# Altium schematic sheet FMC_HPC_TO_LPC_BREAKOUT_ROW_HPC1.SchDoc: High-pin count (HPC) row A, B, and C pass-through
size A4; Date: 12.12.2024; DrawnBy: PFH; Engineer: PFH; DocumentNumber: 1; Revision: A; SheetNumber: 2; SheetTotal: 3; Projekt: FMC HPC to LPC breakout module (single width); Website: www.fmchub.com; ProjectName: FMC_Single_LPC_BREAKOUT
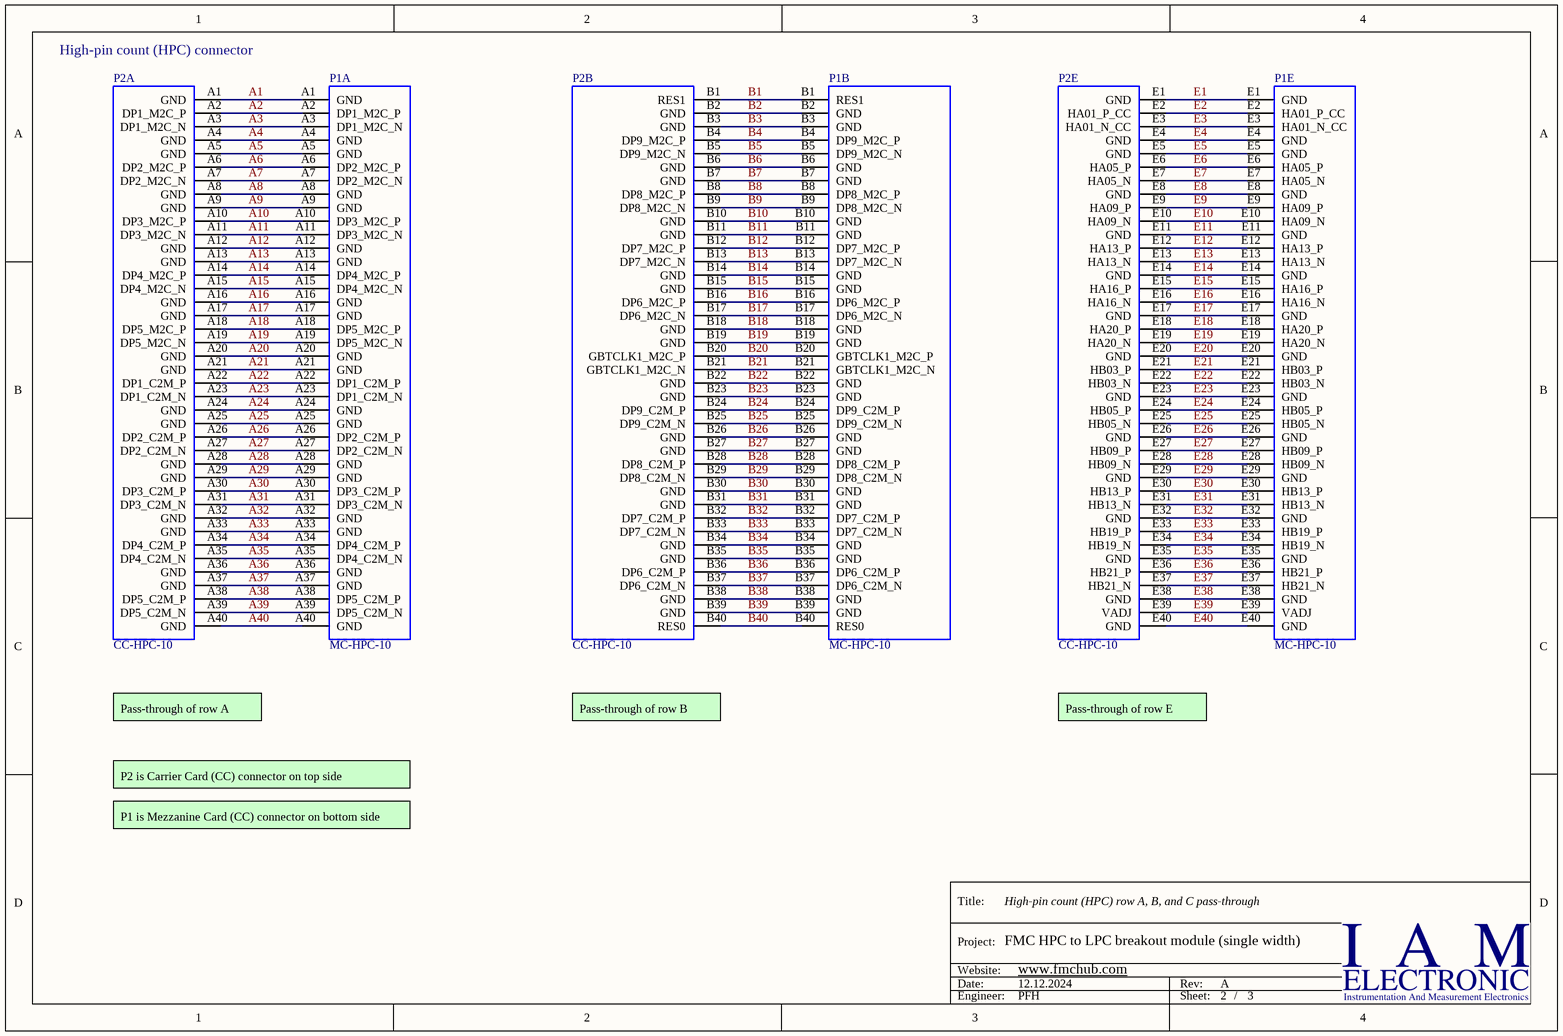
[diagram p0: FMC_HPC_TO_LPC_BREAKOUT_ROW_HPC1.SchDoc]

## Parts
P1  MC-HPC-10  [ASP-134488-01]  (parts A,B,E of 10)
P2  CC-HPC-10  [ASP-134486-01]  (parts A,B,E of 10)

## Nets
A1: P1.A1(GND) P2.A1(GND)
A2: P1.A2(DP1_M2C_P) P2.A2(DP1_M2C_P)
A3: P1.A3(DP1_M2C_N) P2.A3(DP1_M2C_N)
A4: P1.A4(GND) P2.A4(GND)
A5: P1.A5(GND) P2.A5(GND)
A6: P1.A6(DP2_M2C_P) P2.A6(DP2_M2C_P)
A7: P1.A7(DP2_M2C_N) P2.A7(DP2_M2C_N)
A8: P1.A8(GND) P2.A8(GND)
A9: P1.A9(GND) P2.A9(GND)
A10: P1.A10(DP3_M2C_P) P2.A10(DP3_M2C_P)
A11: P1.A11(DP3_M2C_N) P2.A11(DP3_M2C_N)
A12: P1.A12(GND) P2.A12(GND)
A13: P1.A13(GND) P2.A13(GND)
A14: P1.A14(DP4_M2C_P) P2.A14(DP4_M2C_P)
A15: P1.A15(DP4_M2C_N) P2.A15(DP4_M2C_N)
A16: P1.A16(GND) P2.A16(GND)
A17: P1.A17(GND) P2.A17(GND)
A18: P1.A18(DP5_M2C_P) P2.A18(DP5_M2C_P)
A19: P1.A19(DP5_M2C_N) P2.A19(DP5_M2C_N)
A20: P1.A20(GND) P2.A20(GND)
A21: P1.A21(GND) P2.A21(GND)
A22: P1.A22(DP1_C2M_P) P2.A22(DP1_C2M_P)
A23: P1.A23(DP1_C2M_N) P2.A23(DP1_C2M_N)
A24: P1.A24(GND) P2.A24(GND)
A25: P1.A25(GND) P2.A25(GND)
A26: P1.A26(DP2_C2M_P) P2.A26(DP2_C2M_P)
A27: P1.A27(DP2_C2M_N) P2.A27(DP2_C2M_N)
A28: P1.A28(GND) P2.A28(GND)
A29: P1.A29(GND) P2.A29(GND)
A30: P1.A30(DP3_C2M_P) P2.A30(DP3_C2M_P)
A31: P1.A31(DP3_C2M_N) P2.A31(DP3_C2M_N)
A32: P1.A32(GND) P2.A32(GND)
A33: P1.A33(GND) P2.A33(GND)
A34: P1.A34(DP4_C2M_P) P2.A34(DP4_C2M_P)
A35: P1.A35(DP4_C2M_N) P2.A35(DP4_C2M_N)
A36: P1.A36(GND) P2.A36(GND)
A37: P1.A37(GND) P2.A37(GND)
A38: P1.A38(DP5_C2M_P) P2.A38(DP5_C2M_P)
A39: P1.A39(DP5_C2M_N) P2.A39(DP5_C2M_N)
A40: P1.A40(GND) P2.A40(GND)
B1: P1.B1(RES1) P2.B1(RES1)
B2: P1.B2(GND) P2.B2(GND)
B3: P1.B3(GND) P2.B3(GND)
B4: P1.B4(DP9_M2C_P) P2.B4(DP9_M2C_P)
B5: P1.B5(DP9_M2C_N) P2.B5(DP9_M2C_N)
B6: P1.B6(GND) P2.B6(GND)
B7: P1.B7(GND) P2.B7(GND)
B8: P1.B8(DP8_M2C_P) P2.B8(DP8_M2C_P)
B9: P1.B9(DP8_M2C_N) P2.B9(DP8_M2C_N)
B10: P1.B10(GND) P2.B10(GND)
B11: P1.B11(GND) P2.B11(GND)
B12: P1.B12(DP7_M2C_P) P2.B12(DP7_M2C_P)
B13: P1.B13(DP7_M2C_N) P2.B13(DP7_M2C_N)
B14: P1.B14(GND) P2.B14(GND)
B15: P1.B15(GND) P2.B15(GND)
B16: P1.B16(DP6_M2C_P) P2.B16(DP6_M2C_P)
B17: P1.B17(DP6_M2C_N) P2.B17(DP6_M2C_N)
B18: P1.B18(GND) P2.B18(GND)
B19: P1.B19(GND) P2.B19(GND)
B20: P1.B20(GBTCLK1_M2C_P) P2.B20(GBTCLK1_M2C_P)
B21: P1.B21(GBTCLK1_M2C_N) P2.B21(GBTCLK1_M2C_N)
B22: P1.B22(GND) P2.B22(GND)
B23: P1.B23(GND) P2.B23(GND)
B24: P1.B24(DP9_C2M_P) P2.B24(DP9_C2M_P)
B25: P1.B25(DP9_C2M_N) P2.B25(DP9_C2M_N)
B26: P1.B26(GND) P2.B26(GND)
B27: P1.B27(GND) P2.B27(GND)
B28: P1.B28(DP8_C2M_P) P2.B28(DP8_C2M_P)
B29: P1.B29(DP8_C2M_N) P2.B29(DP8_C2M_N)
B30: P1.B30(GND) P2.B30(GND)
B31: P1.B31(GND) P2.B31(GND)
B32: P1.B32(DP7_C2M_P) P2.B32(DP7_C2M_P)
B33: P1.B33(DP7_C2M_N) P2.B33(DP7_C2M_N)
B34: P1.B34(GND) P2.B34(GND)
B35: P1.B35(GND) P2.B35(GND)
B36: P1.B36(DP6_C2M_P) P2.B36(DP6_C2M_P)
B37: P1.B37(DP6_C2M_N) P2.B37(DP6_C2M_N)
B38: P1.B38(GND) P2.B38(GND)
B39: P1.B39(GND) P2.B39(GND)
B40: P1.B40(RES0) P2.B40(RES0)
E1: P1.E1(GND) P2.E1(GND)
E2: P1.E2(HA01_P_CC) P2.E2(HA01_P_CC)
E3: P1.E3(HA01_N_CC) P2.E3(HA01_N_CC)
E4: P1.E4(GND) P2.E4(GND)
E5: P1.E5(GND) P2.E5(GND)
E6: P1.E6(HA05_P) P2.E6(HA05_P)
E7: P1.E7(HA05_N) P2.E7(HA05_N)
E8: P1.E8(GND) P2.E8(GND)
E9: P1.E9(HA09_P) P2.E9(HA09_P)
E10: P1.E10(HA09_N) P2.E10(HA09_N)
E11: P1.E11(GND) P2.E11(GND)
E12: P1.E12(HA13_P) P2.E12(HA13_P)
E13: P1.E13(HA13_N) P2.E13(HA13_N)
E14: P1.E14(GND) P2.E14(GND)
E15: P1.E15(HA16_P) P2.E15(HA16_P)
E16: P1.E16(HA16_N) P2.E16(HA16_N)
E17: P1.E17(GND) P2.E17(GND)
E18: P1.E18(HA20_P) P2.E18(HA20_P)
E19: P1.E19(HA20_N) P2.E19(HA20_N)
E20: P1.E20(GND) P2.E20(GND)
E21: P1.E21(HB03_P) P2.E21(HB03_P)
E22: P1.E22(HB03_N) P2.E22(HB03_N)
E23: P1.E23(GND) P2.E23(GND)
E24: P1.E24(HB05_P) P2.E24(HB05_P)
E25: P1.E25(HB05_N) P2.E25(HB05_N)
E26: P1.E26(GND) P2.E26(GND)
E27: P1.E27(HB09_P) P2.E27(HB09_P)
E28: P1.E28(HB09_N) P2.E28(HB09_N)
E29: P1.E29(GND) P2.E29(GND)
E30: P1.E30(HB13_P) P2.E30(HB13_P)
E31: P1.E31(HB13_N) P2.E31(HB13_N)
E32: P1.E32(GND) P2.E32(GND)
E33: P1.E33(HB19_P) P2.E33(HB19_P)
E34: P1.E34(HB19_N) P2.E34(HB19_N)
E35: P1.E35(GND) P2.E35(GND)
E36: P1.E36(HB21_P) P2.E36(HB21_P)
E37: P1.E37(HB21_N) P2.E37(HB21_N)
E38: P1.E38(GND) P2.E38(GND)
E39: P1.E39(VADJ) P2.E39(VADJ)
E40: P1.E40(GND) P2.E40(GND)

## Notes on the sheet
- (near P2) High-pin count (HPC) connector
- Pass-through of row A
- Pass-through of row B
- Pass-through of row E
- P2 is Carrier Card (CC) connector on top side
- P1 is Mezzanine Card (CC) connector on bottom side
- Title:
- Project:
- Date:
- Website:
- Rev:
- Engineer:
- Sheet:
- /

## Library data of the parts
P1 = MC-HPC-10: MC-HPC-10, FMC High-pin count connector, lead free, 400 I/Os, male, 10 mm mated stack height; Manufacturer: Samtec; Manufacturer Ref: SEAM-40-03.5-S-10-2-A-K-TR-VITA57.0; Pitch: 1.27 mm; Mated Stack Height: 10 mm; Solder Type: Lead-Free; Number I/O: 400; PartName: ASP-134488-01; Part: ASP-134488-01; Vita PartNumber: MC-HPC-10; Pin Count: High; Gender: male; Supplier 1: Digi-Key; Supplier Part Number 1: SAM8730-ND
P2 = CC-HPC-10: CC-HPC-10, FMC High-pin count connector, lead free, 400 I/Os, female, 10 mm mated stack height; Manufacturer: Samtec; Manufacturer Ref: SEAF-40-06.5-10-A; Pitch: 1.27 mm; Mated Stack Height: 10 mm; Solder Type: Lead-Free; Number I/O: 400; PartName: ASP-134486-01; Part: ASP-134486-01; Vita PartNumber: CC-HPC-10; Pin Count: High; Gender: female; Supplier 1: Digi-Key; Supplier Part Number 1: SAM8728-ND